# EAGLE design G888-mk2 (EAGLE 6.6.0)

## Sheet 1 of 4
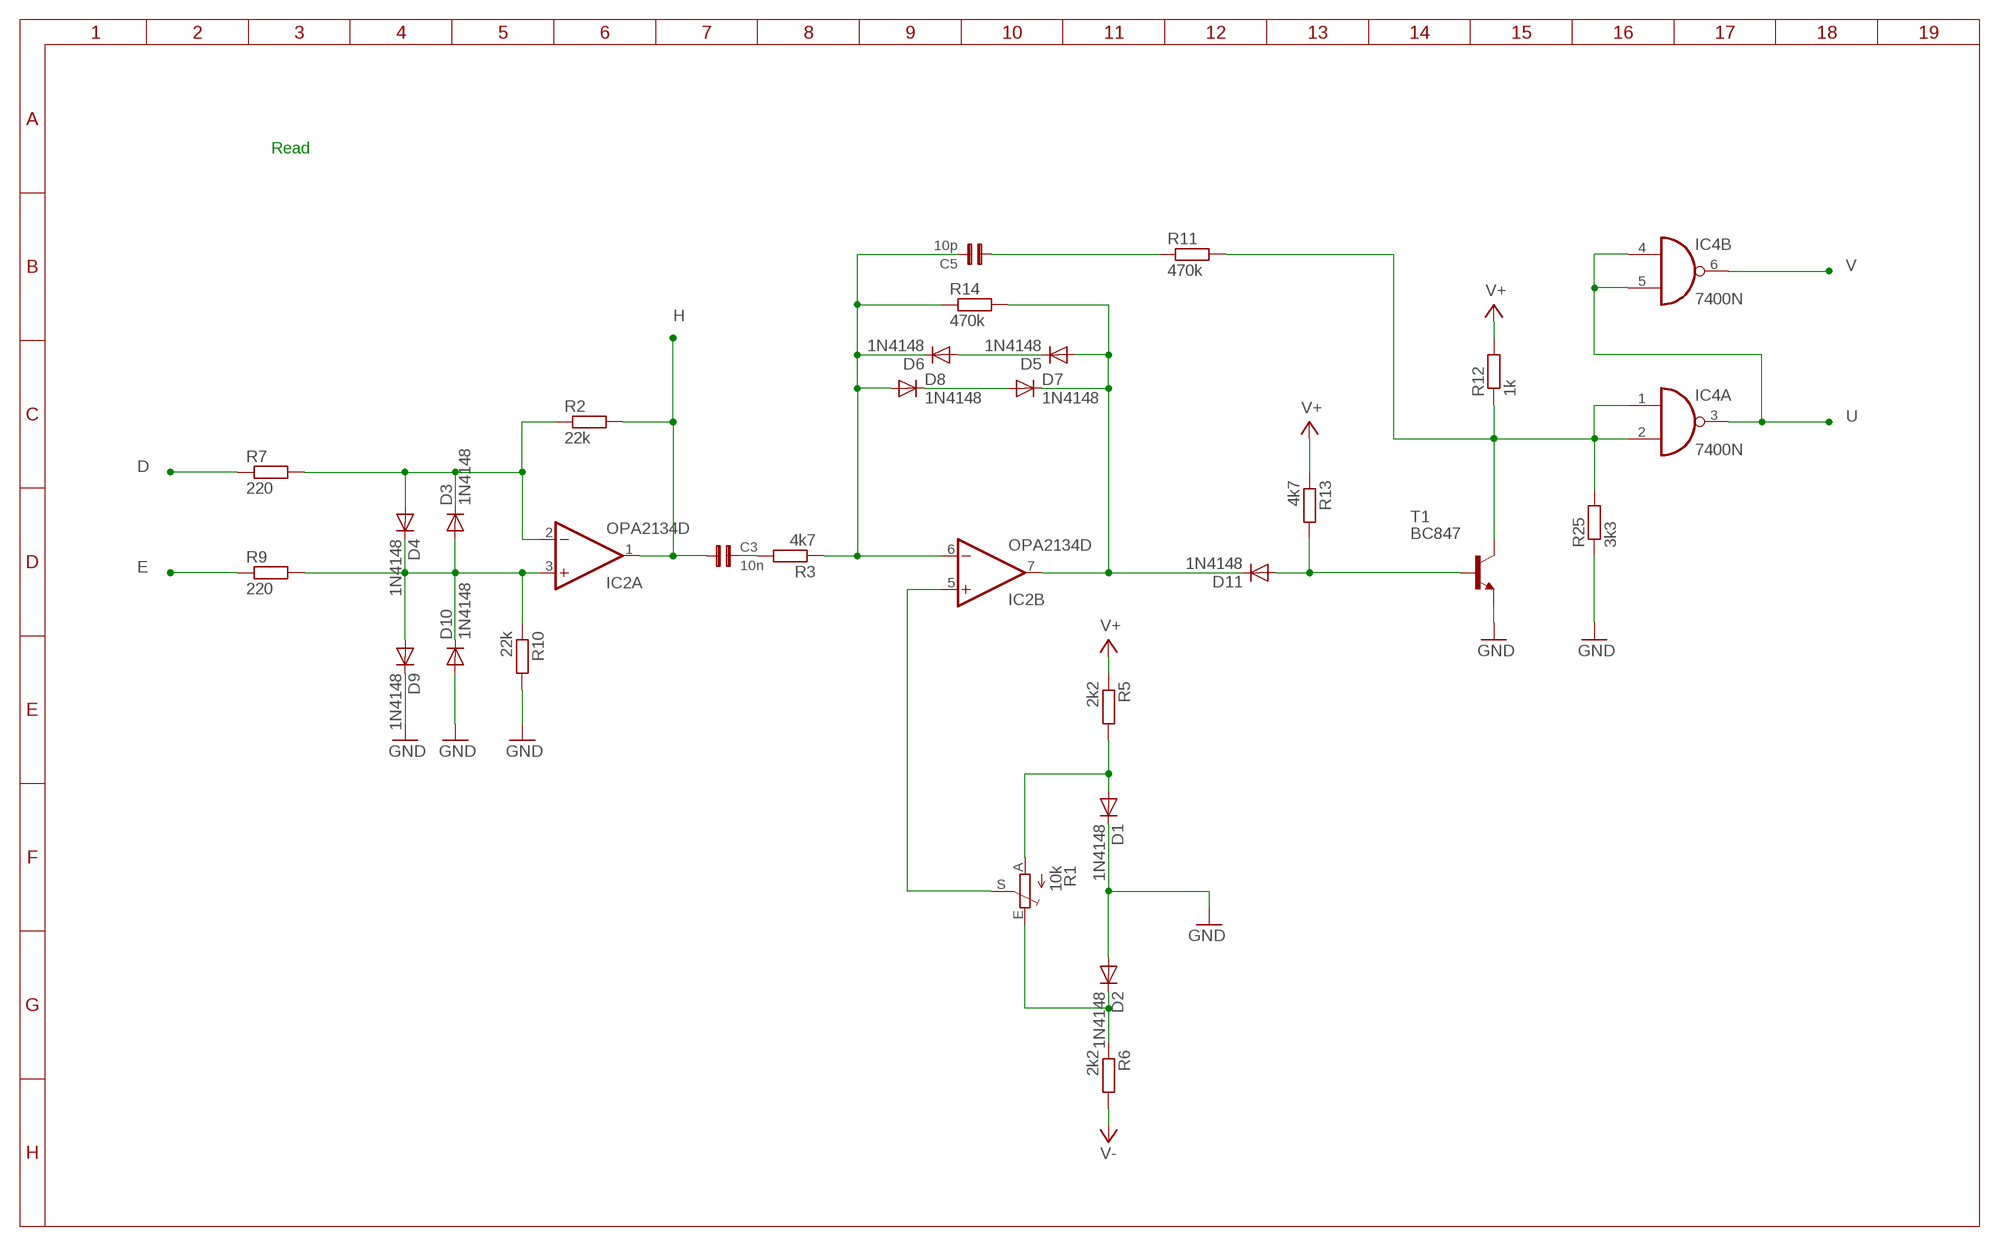
[diagram p0: schematic, sheet 1]

### Parts
C3  10n  C0805  [0805]
C5  10p  C0805  [0805]
D1  1N4148  1N4148-Y  [SOD123]
D2  1N4148  1N4148-Y  [SOD123]
D3  1N4148  1N4148-Y  [SOD123]
D4  1N4148  1N4148-Y  [SOD123]
D5  1N4148  1N4148-Y  [SOD123]
D6  1N4148  1N4148-Y  [SOD123]
D7  1N4148  1N4148-Y  [SOD123]
D8  1N4148  1N4148-Y  [SOD123]
D9  1N4148  1N4148-Y  [SOD123]
D10  1N4148  1N4148-Y  [SOD123]
D11  1N4148  1N4148-Y  [SOD123]
IC2  OPA2134D  [SOIC8]
IC4  7400N  [DIL14]
R1  10k  TRIM_EU-SP19L  [SP19L]
R2  22k  R-EU_R0805  [R0805]
R3  4k7  R-EU_R0805  [R0805]
R5  2k2  R-EU_R0805  [R0805]
R6  2k2  R-EU_R0805  [R0805]
R7  220  R-EU_R0805  [R0805]
R9  220  R-EU_R0805  [R0805]
R10  22k  R-EU_R0805  [R0805]
R11  470k  R-EU_R0805  [R0805]
R12  1k  R-EU_R0805  [R0805]
R13  4k7  R-EU_R0805  [R0805]
R14  470k  R-EU_R0805  [R0805]
R25  3k3  R-EU_R0805  [R0805]
T1  BC847  [SOT23]

### Nets
D: R7.1 ; also sheet 3
E: R9.1 ; also sheet 3
GND: D1.C D2.A D9.C D10.A R10.2 R25.1 T1.2(E) ; also sheet 3,4
H: C3.1 IC2.1(A:OUT) R2.2 ; also sheet 3
N$1: D3.C D4.A IC2.2(A:-IN) R2.1 R7.2
N$4: D5.C D6.A
N$5: C5.2 D6.C D8.A IC2.6(B:-IN) R3.1 R14.1
N$6: D1.A R1.A R5.2
N$7: D5.A D7.C D11.C IC2.7(B:OUT) R14.2
N$8: D11.A R13.2 T1.1(B)
N$9: C5.1 R11.1
N$10: D7.A D8.C
N$11: D2.C R1.E R6.1
N$12: C3.2 R3.2
N$15: IC2.5(B:+IN) R1.S
N$128: D3.A D4.C D9.A D10.C IC2.3(A:+IN) R9.2 R10.1
TIMING: IC4.1(A:I0) IC4.2(A:I1) R11.2 R12.1 R25.2 T1.3(C)
U: IC4.3(A:O) IC4.4(B:I0) IC4.5(B:I1) ; also sheet 3
V: IC4.6(B:O) ; also sheet 3
V+: R5.1 R12.2 R13.1 ; also sheet 2,3,4
V-: R6.2 ; also sheet 4

### Notes on the sheet
- Read

## Sheet 2 of 4
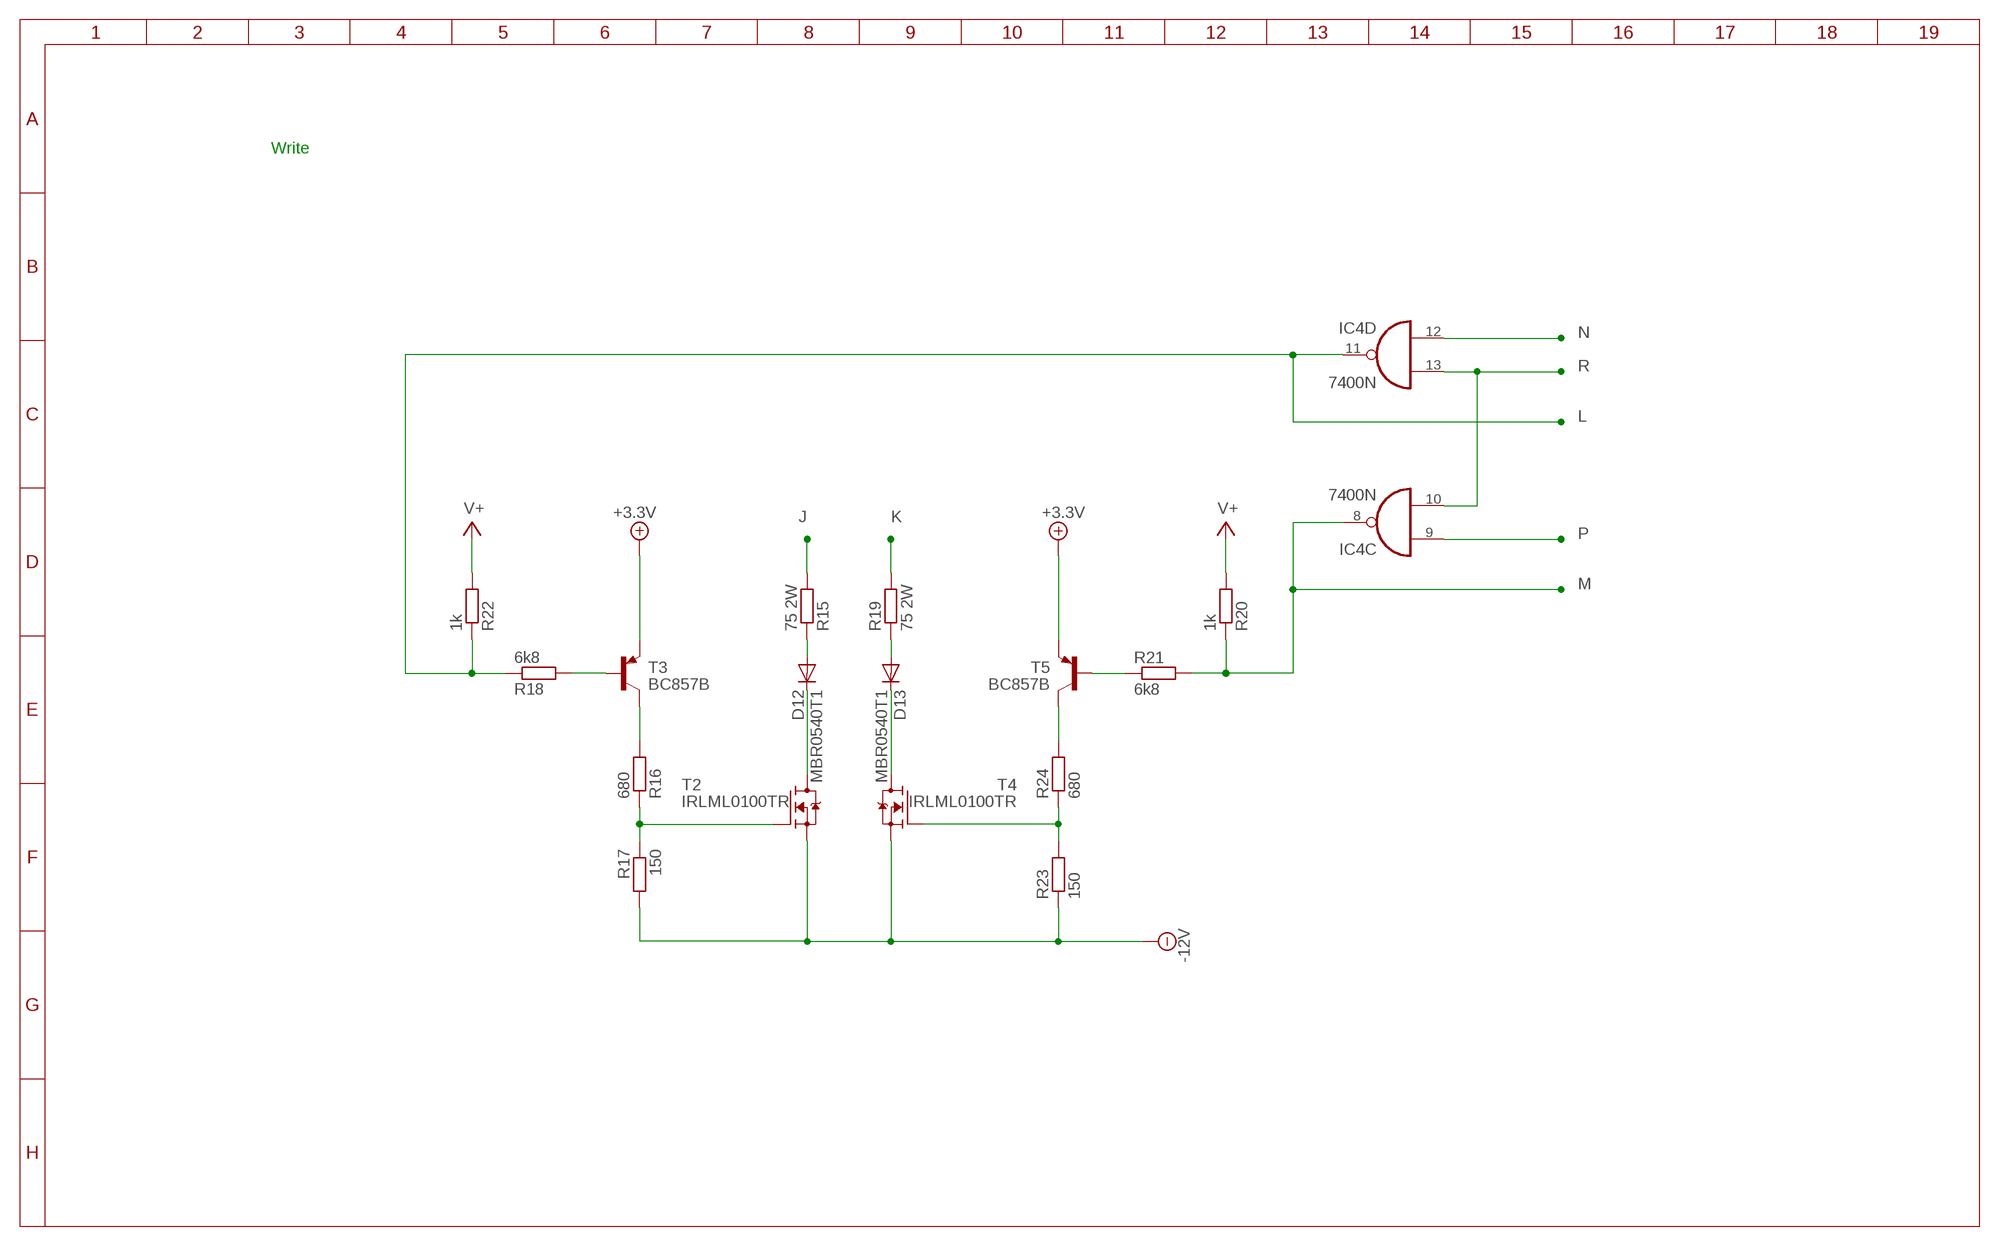
[diagram p1: schematic, sheet 2]

### Parts
D12  MBR0540T1  [SOD123]
D13  MBR0540T1  [SOD123]
R15  75 2W  R-EU_R2512  [R2512]
R16  680  R-EU_R0805  [R0805]
R17  150  R-EU_R0805  [R0805]
R18  6k8  R-EU_R0805  [R0805]
R19  75 2W  R-EU_R2512  [R2512]
R20  1k  R-EU_R0805  [R0805]
R21  6k8  R-EU_R0805  [R0805]
R22  1k  R-EU_R0805  [R0805]
R23  150  R-EU_R0805  [R0805]
R24  680  R-EU_R0805  [R0805]
T2  IRLML0100TR  [SOT23]
T3  BC857B  [SOT23]
T4  IRLML0100TR  [SOT23]
T5  BC857B  [SOT23]

### Nets
+3.3V: T3.2(E) T5.2(E) ; also sheet 4
-12V: R17.2 R23.1 T2.2(S) T4.2(S) ; also sheet 4
J: R15.2 ; also sheet 3
K: R19.2 ; also sheet 3
L: IC4.11(D:O) R18.1 R22.1 ; also sheet 3
M: IC4.8(C:O) R20.1 R21.2 ; also sheet 3
N: IC4.12(D:I0) ; also sheet 3
N$131: R21.1 T5.1(B)
N$132: D13.A R19.1
N$135: D13.C T4.3(D)
N$136: R24.2 T5.3(C)
N$139: R23.2 R24.1 T4.1(G)
N$140: R18.2 T3.1(B)
N$143: D12.A R15.1
N$144: D12.C T2.3(D)
N$145: R16.2 T3.3(C)
N$146: R16.1 R17.1 T2.1(G)
P: IC4.9(C:I0) ; also sheet 3
R: IC4.10(C:I1) IC4.13(D:I1) ; also sheet 3
V+: R20.2 R22.2 ; also sheet 1,3,4

### Notes on the sheet
- Write

## Sheet 3 of 4
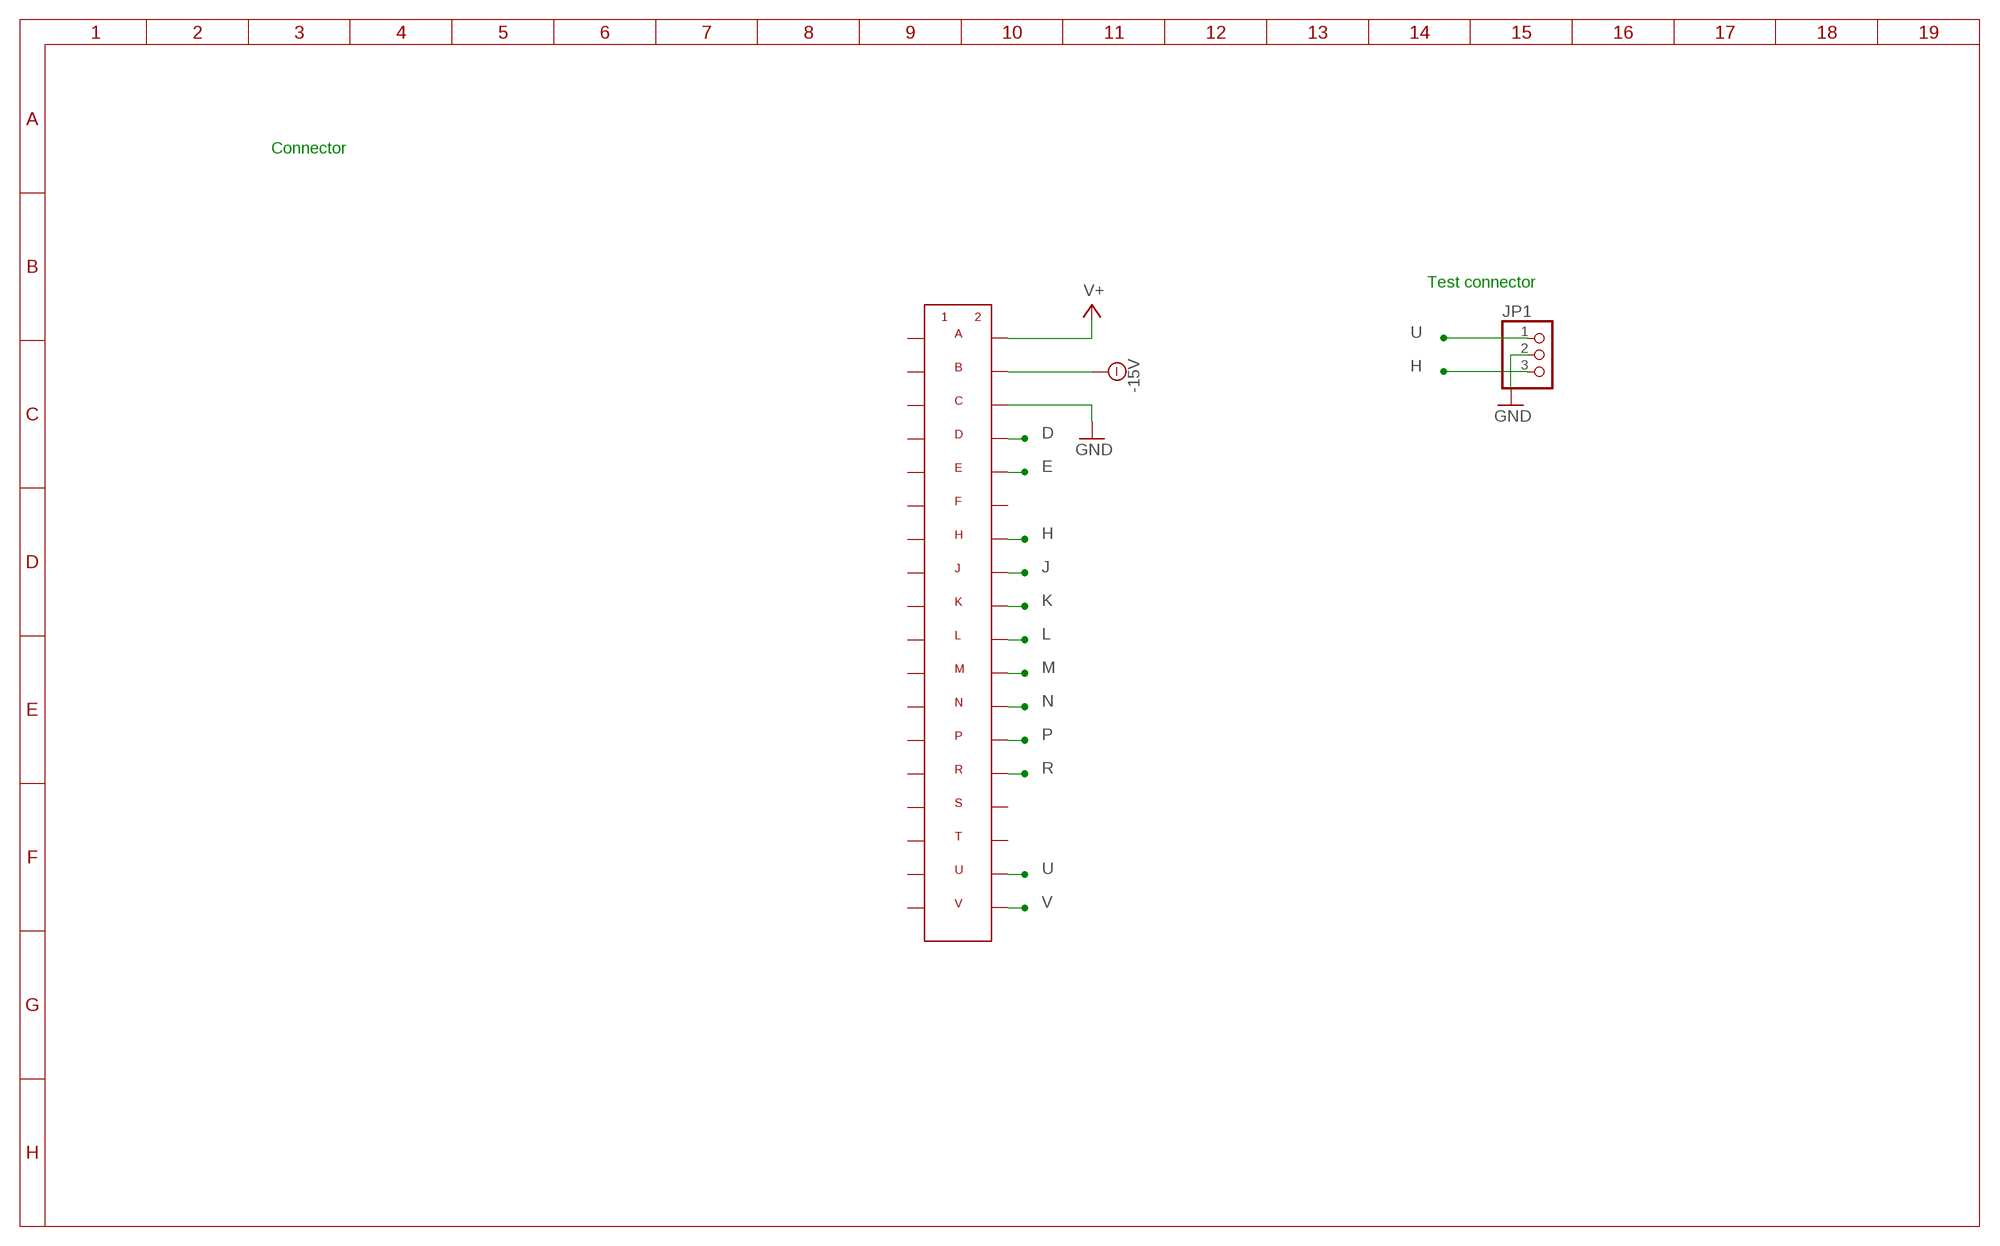
[diagram p2: schematic, sheet 3]

### Parts
CON1  FLIPCHIP_1NORMAL  [FLIPCHIP-1]
JP1  PINHD-1X3/90  [1X03/90]

### Nets
-15V: CON1.B2 ; also sheet 4
D: CON1.D2 ; also sheet 1
E: CON1.E2 ; also sheet 1
GND: CON1.C2 JP1.2 ; also sheet 1,4
H: CON1.H2(G2) JP1.3 ; also sheet 1
J: CON1.J2 ; also sheet 2
K: CON1.K2 ; also sheet 2
L: CON1.L2 ; also sheet 2
M: CON1.M2 ; also sheet 2
N: CON1.N2 ; also sheet 2
P: CON1.P2 ; also sheet 2
R: CON1.R2 ; also sheet 2
U: CON1.U2 JP1.1 ; also sheet 1
V: CON1.V2 ; also sheet 1
V+: CON1.A2 ; also sheet 1,2,4
Unconnected: CON1.A1 CON1.B1 CON1.C1 CON1.D1 CON1.E1 CON1.F1 CON1.F2 CON1.H1 CON1.J1 CON1.K1 CON1.L1 CON1.M1 CON1.N1 CON1.P1 CON1.R1 CON1.S1 CON1.S2 CON1.T1 CON1.T2 CON1.U1 CON1.V1

### Notes on the sheet
- Connector
- Test connector

## Sheet 4 of 4
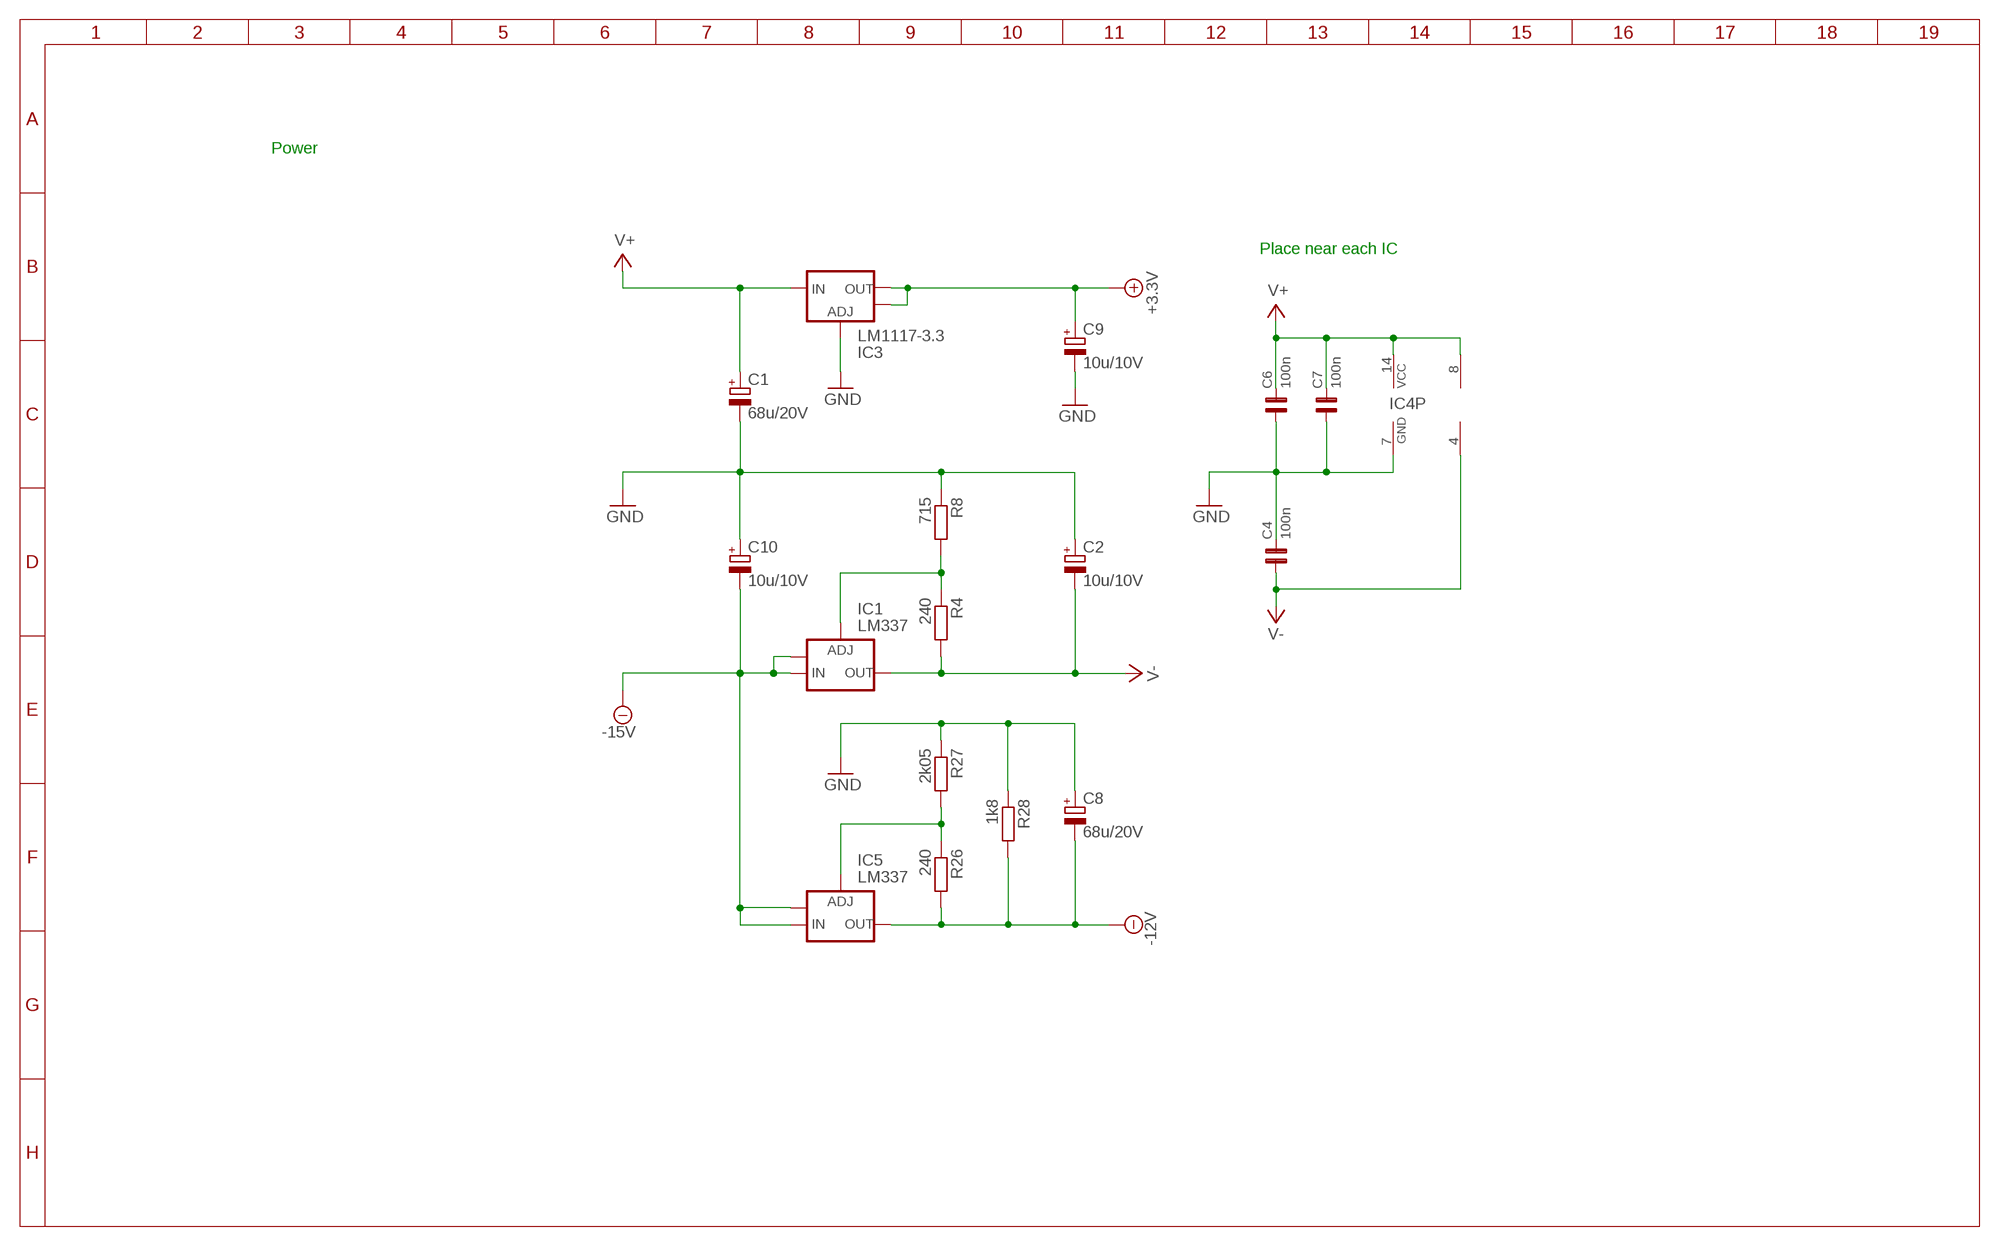
[diagram p3: schematic, sheet 4]

### Parts
C1  68u/20V  CPOL-EUSMCD  [SMC_D]
C2  10u/10V  CPOL-EUSMCC  [SMC_C]
C4  100n  C0805  [0805]
C6  100n  C0805  [0805]
C7  100n  C0805  [0805]
C8  68u/20V  CPOL-EUSMCD  [SMC_D]
C9  10u/10V  CPOL-EUSMCC  [SMC_C]
C10  10u/10V  CPOL-EUSMCC  [SMC_C]
IC1  LM337  LM337-SOT223  [SOT223]
IC3  LM1117-3.3  [SOT223]
IC5  LM337  LM337-SOT223  [SOT223]
R4  240  R-EU_R0805  [R0805]
R8  715  R-EU_R0805  [R0805]
R26  240  R-EU_R0805  [R0805]
R27  2k05  R-EU_R0805  [R0805]
R28  1k8  R-EU_R0805  [R0805]

### Nets
+3.3V: C9.+ IC3.2(OUT) IC3.4(OUT_TAB) ; also sheet 2
-12V: C8.- IC5.3(OUT) R26.2 R28.2 ; also sheet 2
-15V: C10.- IC1.2(IN) IC1.4(IN_TAB) IC5.2(IN) IC5.4(IN_TAB) ; also sheet 3
GND: C1.- C2.+ C4.2 C6.1 C7.1 C8.+ C9.- C10.+ IC3.1(GND) IC4.7(P:GND) R8.1 R27.1 R28.1 ; also sheet 1,3
N$17: IC5.1(ADJ) R26.1 R27.2
N$96: IC1.1(ADJ) R4.1 R8.2
V+: C1.+ C6.2 C7.2 IC2.8(P:V+) IC3.3(IN) IC4.14(P:VCC) ; also sheet 1,2,3
V-: C2.- C4.1 IC1.3(OUT) IC2.4(P:V-) R4.2 ; also sheet 1

### Notes on the sheet
- Power
- Place near each IC

## Library data of the parts
C1 C2 C8-C10 = anders:CPOL-EU: POLARIZED CAPACITOR, European symbol
C3-C7 = capsmd:C0805
CON1 = anders:FLIPCHIP_1: DEC Digital equipment single flipchip
D1-D11 = diode:1N4148: DIODE high speed (Philips)
D12 D13 = anders:MBR0540T1: Schottky diod 0,5A Elfa: 70-031-90
IC1 IC5 = v-reg:LM337-SOT223: LM337 surface mount
IC2 = linear:OPA2134: SoundPLUS (TM) High Performance AUDIO OPERATIONAL AMPLIFIERS Source: http://focus.ti.com/lit/ds/sbos058/sbos058.pdf
IC3 = v-reg:LM1117
IC4 = 74xx-eu:74*00: Quad 2-input NAND gate
JP1 = pinhead:PINHD-1X3: PIN HEADER
R1 = anders:TRIM_EU-: POTENTIOMETER
R2-R28 = anders:R-EU_: RESISTOR, European symbol
T1 = transistor:BC847: NPN TRANSISTOR
T2 T4 = anders:IRLML0100TR: N-channel MOSFET
T3 T5 = anders:BC857B: PNP Transistor

## Board
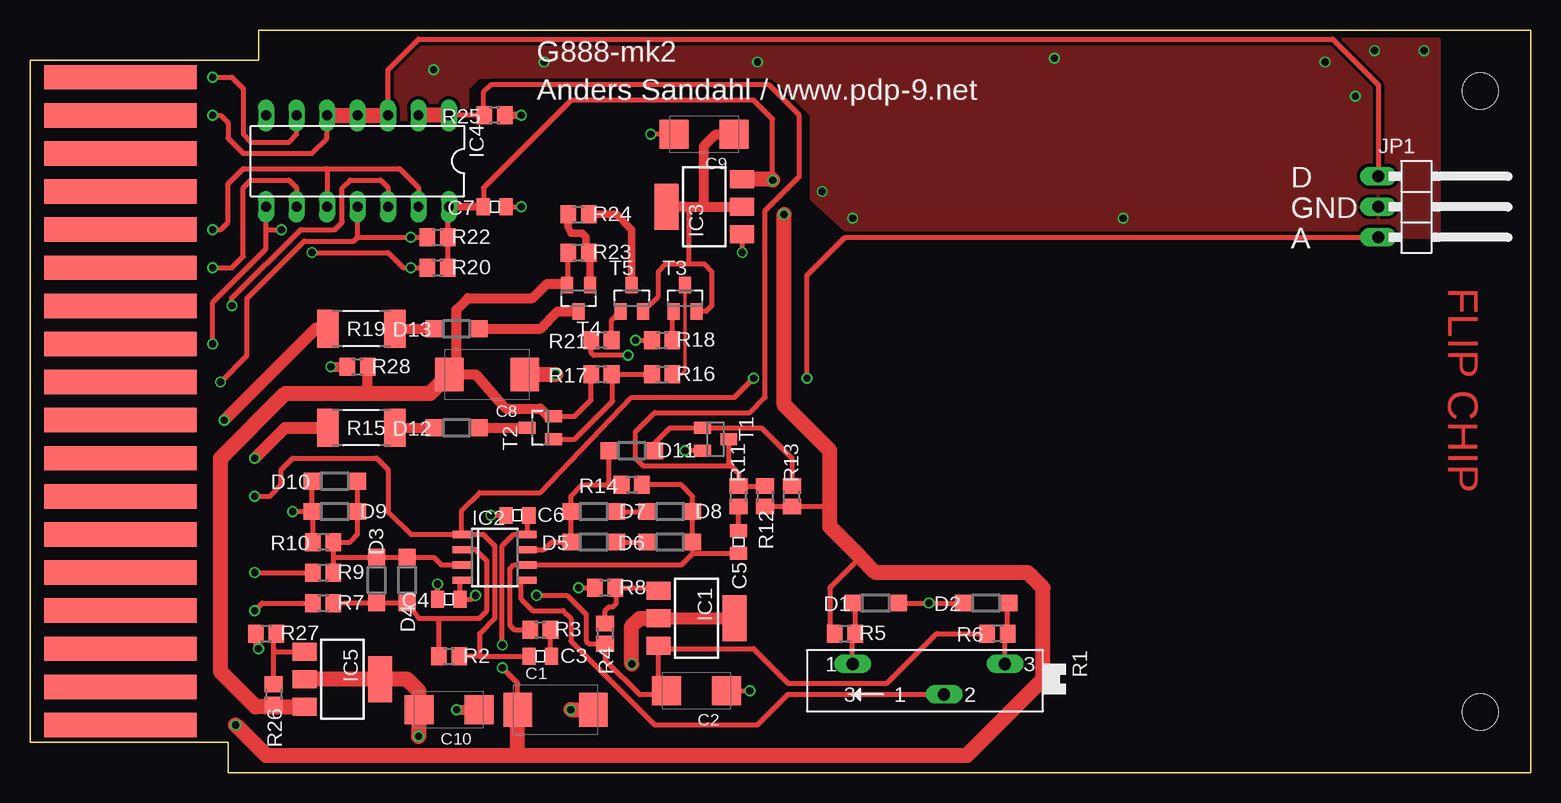
[diagram p4: board, top side]
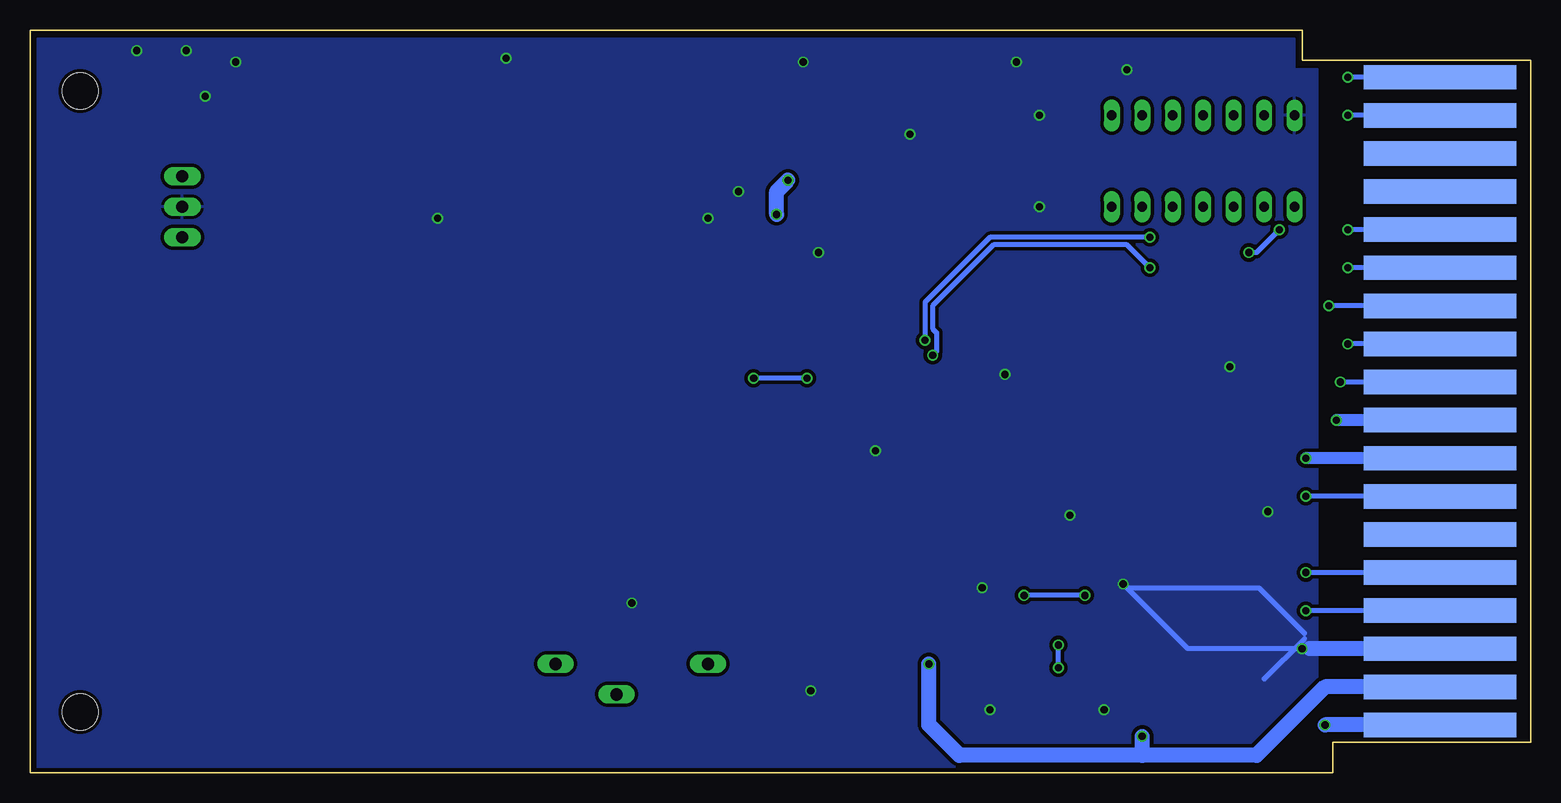
[diagram p5: board, bottom side, seen from below]

Size 125.09 x 61.91 mm. Coordinates in mm from the lower left corner, seen from the top.
Copper layers (1*16): Top 0.035mm / dielectric 1.5mm / Bottom 0.035mm
Design rules "SeeedStudio_2layer_DRU_no_angle_20140221": minimum track width 6mil, minimum drill 12mil, track to track 6mil, track to pad 6mil, pad to pad 6mil, via to via 6mil, smd to smd 0mil, copper to edge 10mil, drill to drill 10mil, minimum pad ring 10mil, minimum via ring 6mil, stop-mask expansion 2mil, vias tented up to drill 100mil, thermal gap 10mil

### Footprints (pad centres in the part's own frame; a part is rotated, then mirrored left to right if it is on the bottom)
SMC_D = smd 2.4 x 2.8: + -3.15,0; - 3.15,0
SMC_C = smd 2.4 x 2.4: + -2.5,0; - 2.5,0
0805 = smd 1.092 x 1.397: 1 -0.94,0; 2 0.94,0
FLIPCHIP-1 = smd 12.7 x 2.032: A1 0.572,0; B1 0.572,3.175; C1 0.572,6.35; D1 0.572,9.525; E1 0.572,12.7; F1 0.572,15.875; H1 0.572,19.05; J1 0.572,22.225; K1 0.572,25.4; L1 0.572,28.575; M1 0.572,31.75; N1 0.572,34.925; P1 0.572,38.1; R1 0.572,41.275; S1 0.572,44.45; T1 0.572,47.625; U1 0.572,50.8; V1 0.572,53.975 | smd 12.7 x 2.032 bottom: A2 0.572,0; B2 0.572,3.175; C2 0.572,6.35; D2 0.572,9.525; E2 0.572,12.7; F2 0.572,15.875; H2 0.572,19.05; J2 0.572,22.225; K2 0.572,25.4; L2 0.572,28.575; M2 0.572,31.75; N2 0.572,34.925; P2 0.572,38.1; R2 0.572,41.275; S2 0.572,44.45; T2 0.572,47.625; U2 0.572,50.8; V2 0.572,53.975 | hole 3: 113.919,52.832; 113.919,1.079
SOD123 = smd 1.4 x 1.4: A 1.9,0; C -1.9,0
SOT223 = smd 1.5 x 2: 1 -2.3,-3.15; 2 0,-3.15; 3 2.3,-3.15 | smd 3.8 x 2: 4 0,3.15
SOIC8 = smd 0.6 x 1.5: 1 -1.905,-2.75; 2 -0.635,-2.75; 3 0.635,-2.75; 4 1.905,-2.75; 5 1.905,2.75; 6 0.635,2.75; 7 -0.635,2.75; 8 -1.905,2.75
DIL14 = drill 0.813 long: 1 -7.62,-3.81; 2 -5.08,-3.81; 3 -2.54,-3.81; 4 0,-3.81; 5 2.54,-3.81; 6 5.08,-3.81; 7 7.62,-3.81; 8 7.62,3.81; 9 5.08,3.81; 10 2.54,3.81; 11 0,3.81; 12 -2.54,3.81; 13 -5.08,3.81; 14 -7.62,3.81
1X03/90 = drill 1.016 long: 1 -2.54,-3.81; 2 0,-3.81; 3 2.54,-3.81
SP19L = drill 1.016 long: A 5.715,-1.27; E -6.985,-1.27; S -1.905,1.27
R0805 = smd 1.3 x 1.5: 1 -0.85,0; 2 0.85,0
R2512 = smd 1.8 x 3.2: 1 -2.8,0; 2 2.8,0
SOT23 = smd 1 x 1.4: 1 -0.95,-1.1; 2 0.95,-1.1; 3 0,1.1

### Placement (x,y rotation side)
C1  43.81,5.27 0 top
C2  55.56,6.86 180 top
C3  42.55,9.72 0 top
C4  34.92,14.48 180 top
C5  59.05,19.24 270 top
C6  40.64,21.46 0 top
C7  38.73,47.18 180 top
C8  38.1,33.21 180 top
C9  56.2,53.21 180 top
C10  34.92,5.27 180 top
CON1  6.99,4 0 top
D1  70.48,14.16 180 top
D2  79.69,14.16 180 top
D3  28.89,16.07 90 top
D4  31.43,16.07 270 top
D5  46.99,19.24 180 top
D6  53.34,19.24 180 top
D7  46.99,21.78 0 top
D8  53.34,21.78 0 top
D9  25.4,21.78 0 top
D10  25.4,24.32 180 top
D11  50.16,26.86 0 top
D12  35.56,28.77 180 top
D13  35.56,37.02 180 top
IC1  55.56,12.89 270 top
IC2  38.73,17.97 270 top
IC3  56.2,47.18 90 top
IC4  27.3,50.99 180 top
IC5  26.04,7.81 270 top
JP1  116.2,47.18 270 top
R1  74.3,7.81 180 top
R2  34.92,9.72 0 top
R3  42.55,11.94 0 top
R4  47.94,11.62 270 top
R5  67.94,11.62 0 top
R6  80.64,11.62 180 top
R7  24.45,14.16 0 top
R8  47.94,15.43 0 top
R9  24.45,16.7 0 top
R10  24.45,19.24 180 top
R11  59.05,23.05 90 top
R12  61.28,23.05 270 top
R13  63.5,23.05 90 top
R14  50.16,24 180 top
R15  27.62,28.77 180 top
R16  52.7,33.21 0 top
R17  47.62,33.21 180 top
R18  52.7,36.07 0 top
R19  27.62,37.02 180 top
R20  33.97,42.1 0 top
R21  47.62,36.07 180 top
R22  33.97,44.64 0 top
R23  45.72,43.37 0 top
R24  45.72,46.55 0 top
R25  38.73,54.8 180 top
R26  20.32,6.54 270 top
R27  19.68,11.62 0 top
R28  27.3,33.85 0 top
T1  57.15,27.81 270 top
T2  42.55,28.77 90 top
T3  54.61,39.56 0 top
T4  45.72,39.56 180 top
T5  50.16,39.56 0 top

### Tracks (layer width: path | path; a pad name or v marks a point on that pad's centre or on a via)
+3.3V
  Top 0.305: T3.2
  Top 0.406: T3.2 56.37,38.46 56.83,38.93 56.83,41.78 56.2,42.42 54.93,42.42 | 54.93,42.42 53.02,42.42 52.39,41.78 52.39,39.73 T5.2 | 54.93,42.42 54.93,46.86 54.61,47.18
  Top 0.813: 56.2,47.18 IC3.2 | IC3.4 54.61,47.18 56.2,47.18 | 56.2,47.18 56.2,52.26 57.15,53.21 C9.+
-12V
  Top 0.406: 44.87,40.76 R23.1 | T4.2 43.91,40.66 43.81,40.76 | R17.2 46.77,31.09 45.4,29.72 T2.2 | R26.2 19.86,5.69 19.68,5.51
  Top 0.813: 44.87,40.76 43.81,40.76 43.11,40.76 41.91,39.56 36.51,39.56 35.56,38.61 35.56,33.21 37.15,33.21 39.37,30.67 39.69,30.35 42.55,30.35 43.18,29.72 T2.2 | R28.2 28.15,31.84 27.94,31.62
  Top 1.27: 35.56,33.21 C8.- 33.36,31.62 27.94,31.62 21.27,31.62 15.88,26.23 15.88,8.45 18.81,5.51 19.68,5.51 IC5.3
-15V  (via drill 0.6)
  Top 1.016: IC1.2 IC1.4
  Top 1.27: v50.16,9.08 50.16,12.26 50.8,12.89 IC1.2 | v32.38,3.05 32.42,3.09 C10.- 32.42,6.82 31.43,7.81 IC5.4 IC5.2
  Bottom 1.27: v50.16,9.08 50.16,4 47.62,1.46 32.38,1.46 | CON1.B2 17.14,7.18 22.86,1.46 32.38,1.46 | 32.38,1.46 v32.38,3.05
D  (via drill 0.6)
  Top 0.406: R7.1 19.37,14.16 v18.73,13.53
  Bottom 0.406: CON1.D2 v18.73,13.53
E  (via drill 0.6)
  Top 0.406: v18.73,16.7 R9.1
  Bottom 0.406: CON1.E2 v18.73,16.7
GND  (via drill 0.6)
  Top 0.406: D9.C v21.91,21.78 | D9.C D10.A | R10.2 23.6,22 D9.C | T1.2 56.2,26.86 v54.61,26.86 | C9.- v51.75,53.21 | v59.37,43.37 59.37,44.86 IC3.1 | C2.+ v60.01,6.86 | v45.72,15.43 R8.1 | D1.C v74.93,14.16 D2.A | v38.42,21.46 C6.1 | C4.2 33.98,14.47 v33.97,15.75 | C7.1 v40.96,47.18 | R27.1 18.83,10.57 v19.05,10.35
  Top 0.61: R25.1 v40.96,54.8
  Top 0.813: v35.56,5.27 C10.+ | v25.08,33.85 R28.1
  Top 1.27: v45.09,5.27 C1.- | C8.+ v43.81,33.21
  Bottom 0.406: v40.96,47.18 41.27,47.18 | 18.41,10.35 v19.05,10.35 28.57,10.35 33.66,15.43 22.64,15.43 R27.1 | 22.22,7.81 18.83,11.2
  Bottom 1.27: CON1.C2 18.41,10.35
  other vias: 116.2,60.2 112.08,60.2 107.95,59.25 110.49,56.39 91.12,46.23 68.58,46.23 66.04,48.45 85.41,59.56 60.64,59.25 42.86,59.25 33.66,58.61
  pour Bottom (isolate 0.305): 19.68,61.15 124.46,61.15 124.46,0.51 18.41,0.51 18.41,3.37 17.78,3.37 17.78,58.61 19.68,58.61
  pour Top (isolate 0.305): 117.47,44.64 117.47,61.15 32.38,61.15 29.84,58.61 29.84,54.48 36.51,54.48 36.51,57.02 37.46,57.98 62.23,57.66 65.09,54.8 65.09,47.82 68.58,44.64
H  (via drill 0.6)
  Top 0.406: IC2.1 31.75,19.88 29.84,21.78 29.84,25.27 28.89,26.23 21.91,26.23 20.95,25.27 20.95,24 20,23.05 v18.73,23.05 | IC2.1 37.78,19.88 38.73,18.92 38.73,12.89 37.46,11.62 37.46,9.72 | 37.46,9.72 R2.2 | 37.46,9.72 C3.1 | v64.77,32.89 64.77,41.47 67.94,44.64 JP1.3 | v60.32,32.89 58.74,31.31 50.16,31.31 42.55,23.37 37.46,23.37 35.98,21.89 IC2.1
  Bottom 0.406: CON1.H2 v18.73,23.05 | v60.32,32.89 v64.77,32.89
J  (via drill 0.6)
  Top 1.016: R15.2 21.27,28.77 v18.73,26.23
  Bottom 1.016: CON1.J2 v18.73,26.23
K  (via drill 0.6)
  Top 1.016: v16.19,29.4 23.81,37.02 R19.2
  Bottom 1.016: CON1.K2 v16.19,29.4
L  (via drill 0.6)
  Top 0.406: 27.3,44.64 IC4.11 | 27.3,44.64 v31.75,44.64 R22.1 | 27.3,44.64 26.99,44.32 22.86,44.32 18.1,39.56 18.1,34.8 v15.88,32.58 | v50.48,36.07 R18.1
  Bottom 0.406: CON1.L2 v15.88,32.58 | v31.75,44.64 45.09,44.64 50.48,39.24 v50.48,36.07
M  (via drill 0.6)
  Top 0.406: v15.24,35.75 15.24,39.24 19.68,43.69 19.68,45.28 | 19.68,45.28 IC4.8 | R20.1 v31.75,42.1 31.12,42.1 29.84,43.37 v23.49,43.37 | R21.2 46.77,35.01 46.99,34.8 v49.85,34.8 | 19.68,45.28 v20.95,45.28
  Bottom 0.406: CON1.M2 v15.24,35.75 | v49.85,34.8 49.53,35.12 49.53,36.7 49.85,37.02 49.85,38.93 44.77,44.01 33.66,44.01 v31.75,42.1 | v23.49,43.37 22.86,43.37 v20.95,45.28
N  (via drill 0.6)
  Top 0.406: IC4.12 29.84,48.77 29.21,49.4 26.67,49.4 26.04,48.77 26.04,45.91 25.4,45.28 22.54,45.28 16.83,39.56 v16.83,38.93
  Bottom 0.406: CON1.N2 v16.83,38.93
N$1
  Top 0.406: 34.07,12.89 R2.1 | R7.2 26.25,14.17 D3.C D4.A 32.38,12.89 34.07,12.89 | IC2.2 37.15,18.61 38.1,17.65 38.1,13.53 37.46,12.89 34.07,12.89
N$4
  Top 0.406: D5.C D6.A
N$5
  Top 0.406: R14.1 54.29,24 55.24,23.05 D8.A D6.C 55.24,19.87 55.24,18.3 55.26,18.3 | 55.26,18.3 C5.2 | 55.26,18.3 54.29,17.34 IC2.6 40.32,17.34 40,17.02 40,12.27 40.34,11.94 R3.1
N$6
  Top 0.406: D1.A 68.8,13.95 R5.2 68.58,11.41 R1.A
N$7
  Top 0.406: 48.26,24 46.04,24 45.09,23.05 D7.C D5.A 43.5,19.24 42.86,18.61 IC2.7 | 48.26,24 R14.2 | D11.C 48.27,24.01 48.26,24
N$8
  Top 0.406: D11.A 52.06,27.49 53.34,28.77 T1.1 60.96,28.76 63.5,26.23 R13.2
N$9
  Top 0.406: C5.1 R11.1
N$10
  Top 0.406: D7.A D8.C
N$11
  Top 0.406: R1.E 81.28,11.41 R6.1 81.5,14.06 D2.C
N$12
  Top 0.406: R3.2 43.39,9.81 C3.2
N$15
  Top 0.406: R1.S 63.18,6.54 60.64,4 52.07,4 45.09,10.99 45.09,12.89 44.45,13.53 41.91,13.53 40.96,14.48 40.96,16.07 IC2.5
N$17
  Top 0.406: R26.1 20.32,10.11 | R27.2 20.32,11.41 20.32,10.35 20.32,10.11 | 20.32,10.11 IC5.1
N$96
  Top 0.406: 48.89,15.43 R8.2 | 48.89,15.43 52.17,15.43 IC1.1 | 48.89,15.43 48.89,14.16 48.58,13.84 48.26,13.84 47.94,13.53 R4.1
N$128
  Top 0.406: 25.3,17.97 R10.1 26.67,19.24 27.3,19.88 D9.A D10.C | 25.3,17.97 26.25,17.97 D3.A D4.C | D4.C 32.39,17.97 | R9.2 25.3,17.97 | D4.C 33.65,17.97 33.66,17.97 34.29,17.34 IC2.3
N$131
  Top 0.406: R21.1 48.48,37.72 T5.1
N$132
  Top 0.813: R19.1 D13.A
N$135
  Top 0.813: T4.3 43.98,38.46 42.55,37.02 D13.C
N$136
  Top 0.61: T5.3 50.16,45.28 48.89,46.55 R24.2
N$139
  Top 0.61: T4.1 46.67,43.27 R23.2 46.35,43.59 46.35,44.64 46.04,44.96 45.09,44.96 44.87,45.49 R24.1
N$140
  Top 0.406: R18.2 53.55,38.36 T3.1
N$143
  Top 0.813: R15.1 D12.A
N$144
  Top 0.813: D12.C T2.3
N$145
  Top 0.305: T3.3 54.61,33.53 54.29,33.21 R16.2
N$146
  Top 0.406: R16.1 R17.1 48.58,33.11 48.58,30.99 45.41,27.82 T2.1
P  (via drill 0.6)
  Top 0.406: IC4.9 22.22,48.77 21.59,49.4 18.41,49.4 17.78,48.77 17.78,43.05 16.83,42.1 v15.24,42.1
  Bottom 0.406: CON1.P2 v15.24,42.1
R  (via drill 0.6)
  Top 0.406: IC4.13 32.38,48.77 30.8,50.36 24.77,50.36 | 24.77,50.36 IC4.10 | 24.77,50.36 17.78,50.36 16.51,49.09 16.51,45.91 15.88,45.28 v15.24,45.28
  Bottom 0.406: CON1.R2 v15.24,45.28
TIMING
  Top 0.406: R12.1 R11.2 59.05,24.96 58.42,25.59 | 58.42,25.59 58.25,25.76 T1.3 58.25,27.33 | 58.42,25.59 51.12,25.59 50.48,26.23 50.48,28.45 52.07,30.04 60.01,30.04 61.28,31.31 61.28,46.86 64.14,49.72 64.14,54.8 61.59,57.34 38.42,57.34 37.78,56.71 37.78,54.9 R25.2 IC4.1
  Top 1.27: IC4.1 IC4.2
U  (via drill 0.6)
  Top 0.406: IC4.5 24.77,52.9 23.49,51.63 17.78,51.63 16.51,52.9 16.51,54.17 15.88,54.8 v15.24,54.8 | IC4.3 29.84,58.61 32.38,61.15 108.58,61.15 112.39,57.34 JP1.1
  Top 1.27: IC4.5 IC4.4 IC4.3
  Bottom 0.406: CON1.U2 v15.24,54.8
V  (via drill 0.6)
  Top 0.406: IC4.6 22.22,53.21 21.59,52.58 18.41,52.58 17.78,53.21 17.78,57.02 16.83,57.98 v15.24,57.98
  Bottom 0.406: CON1.V2 v15.24,57.98
V+  (via drill 0.6)
  Top 0.406: R20.2 R22.2 34.82,47.08 IC4.14 | C6.2 41.48,21.03 IC2.8 40.32,19.88 39.37,18.92 v39.37,10.67 | R5.1 66.67,12.04 66.67,15.43 69.22,17.97 | R12.2 R13.1 66.25,22.2 66.67,21.78 | C7.2 37.8,48.78 45.09,56.07 60.32,56.07 61.91,54.48 v61.91,49.4 | C1.+ 40.66,7.47 v39.37,8.76
  Top 0.61: C7.2 IC4.14
  Top 1.016: IC3.3 59.42,49.4
  Top 1.27: v17.14,4 19.68,1.46 40.66,1.46 | 40.66,1.46 78.11,1.46 84.45,7.81 84.45,15.43 83.19,16.7 70.48,16.7 69.22,17.97 66.67,20.51 66.67,21.78 66.67,26.86 62.86,30.67 v62.86,46.55 | IC3.3 61.84,49.48 v61.91,49.4 | 40.66,1.46 C1.+
  Bottom 0.406: v39.37,8.76 v39.37,10.67
  Bottom 1.27: CON1.A2 v17.14,4 | v62.86,46.55 62.86,48.45 v61.91,49.4
V-  (via drill 0.6)
  Top 0.406: C2.- 53.66,7.81 52.41,7.79 IC1.3 52.46,10.59 52.7,10.35 60.32,10.35 63.18,7.49 71.44,7.49 75.56,11.62 R6.2 | 52.81,6.54 50.8,6.54 47.94,9.4 R4.2 46.57,10.77 46.35,10.99 46.35,13.21 44.77,14.8 v42.23,14.8 | IC2.4 35.87,15.87 C4.1 36.82,14.48 v37.15,14.8
  Top 1.27: 52.81,6.54 C2.-
  Bottom 0.406: v37.15,14.8 v42.23,14.8

### Text on the board
tNames: G888-mk2 | Anders Sandahl / www.pdp-9.net | D | GND | A